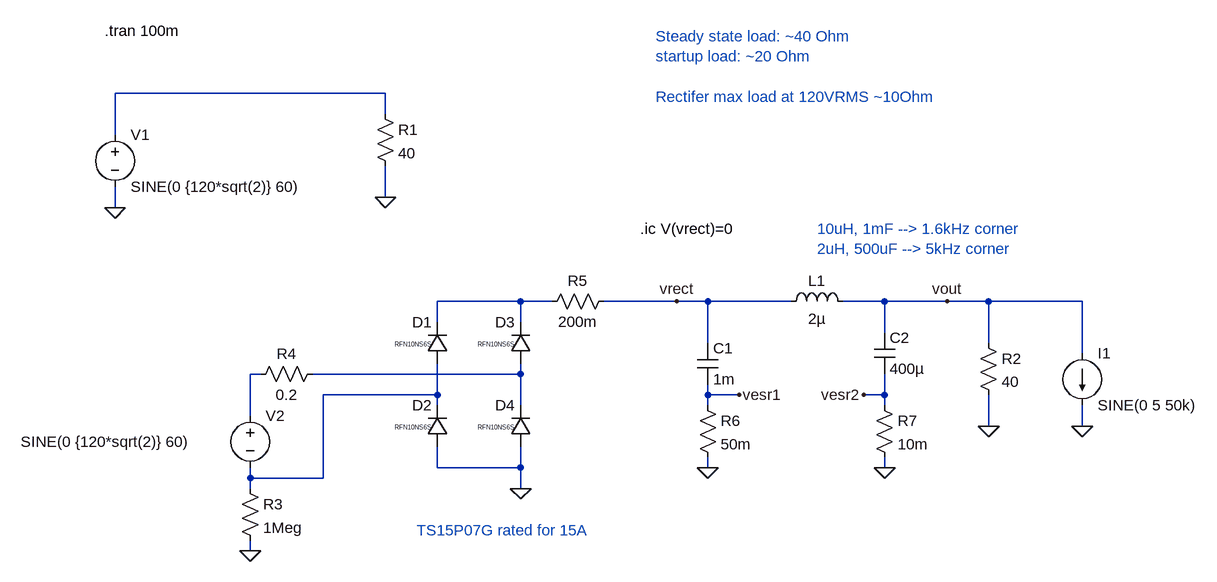
[diagram p0: schematic pump_ac_model.asc]
pump_ac_model.asc, the LTspice schematic file:
Version 4.1
SHEET 1 1792 756
WIRE 528 32 112 32
WIRE 528 64 528 32
WIRE 112 96 112 32
WIRE 528 192 528 144
WIRE 112 208 112 176
WIRE 736 352 608 352
WIRE 784 352 736 352
WIRE 976 352 864 352
WIRE 1024 352 976 352
WIRE 1152 352 1024 352
WIRE 1296 352 1232 352
WIRE 1392 352 1296 352
WIRE 1456 352 1392 352
WIRE 1600 352 1456 352
WIRE 608 384 608 352
WIRE 736 384 736 352
WIRE 1296 400 1296 352
WIRE 1024 416 1024 352
WIRE 1456 416 1456 352
WIRE 1600 432 1600 352
WIRE 336 464 320 464
WIRE 736 464 736 448
WIRE 736 464 416 464
WIRE 608 496 608 448
WIRE 608 496 432 496
WIRE 1024 496 1024 480
WIRE 1072 496 1024 496
WIRE 1296 496 1296 464
WIRE 1296 496 1264 496
WIRE 608 512 608 496
WIRE 736 512 736 464
WIRE 1024 512 1024 496
WIRE 1296 512 1296 496
WIRE 320 528 320 464
WIRE 1456 544 1456 496
WIRE 1600 544 1600 512
WIRE 608 608 608 576
WIRE 736 608 736 576
WIRE 736 608 608 608
WIRE 1024 608 1024 592
WIRE 1296 608 1296 592
WIRE 320 624 320 608
WIRE 432 624 432 496
WIRE 432 624 320 624
WIRE 320 640 320 624
WIRE 736 640 736 608
WIRE 320 736 320 720
FLAG 112 208 0
FLAG 528 192 0
FLAG 320 736 0
FLAG 1456 544 0
FLAG 736 640 0
FLAG 1024 608 0
FLAG 976 352 vrect
FLAG 1296 608 0
FLAG 1600 544 0
FLAG 1392 352 vout
FLAG 1072 496 vesr1
FLAG 1264 496 vesr2
SYMBOL voltage 112 80 R0
WINDOW 123 0 0 Left 0
WINDOW 39 0 0 Left 0
SYMATTR InstName V1
SYMATTR Value SINE(0 {120*sqrt(2)} 60)
SYMBOL res 512 48 R0
SYMATTR InstName R1
SYMATTR Value 40
SYMBOL voltage 320 512 R0
WINDOW 3 -353 56 Left 2
WINDOW 123 0 0 Left 0
WINDOW 39 0 0 Left 0
SYMATTR InstName V2
SYMATTR Value SINE(0 {120*sqrt(2)} 60)
SYMBOL res 1440 400 R0
SYMATTR InstName R2
SYMATTR Value 40
SYMBOL diode 624 448 R180
WINDOW 0 24 64 Left 2
WINDOW 3 24 30 Left 0
SYMATTR InstName D1
SYMATTR Value RFN10NS6S
SYMBOL res 304 624 R0
SYMATTR InstName R3
SYMATTR Value 1Meg
SYMBOL cap 1008 416 R0
SYMATTR InstName C1
SYMATTR Value 1m
SYMBOL diode 624 576 R180
WINDOW 0 24 64 Left 2
WINDOW 3 24 30 Left 0
SYMATTR InstName D2
SYMATTR Value RFN10NS6S
SYMBOL diode 752 448 R180
WINDOW 0 24 64 Left 2
WINDOW 3 24 30 Left 0
SYMATTR InstName D3
SYMATTR Value RFN10NS6S
SYMBOL diode 752 576 R180
WINDOW 0 24 64 Left 2
WINDOW 3 24 30 Left 0
SYMATTR InstName D4
SYMATTR Value RFN10NS6S
SYMBOL res 432 448 R90
WINDOW 0 0 56 VBottom 2
WINDOW 3 32 56 VTop 2
SYMATTR InstName R4
SYMATTR Value 0.2
SYMBOL res 880 336 R90
WINDOW 0 0 56 VBottom 2
WINDOW 3 32 56 VTop 2
SYMATTR InstName R5
SYMATTR Value 200m
SYMBOL ind 1136 368 R270
WINDOW 0 32 56 VTop 2
WINDOW 3 5 56 VBottom 2
SYMATTR InstName L1
SYMATTR Value 2µ
SYMBOL cap 1280 400 R0
SYMATTR InstName C2
SYMATTR Value 400µ
SYMBOL current 1600 432 R0
WINDOW 123 0 0 Left 0
WINDOW 39 0 0 Left 0
SYMATTR InstName I1
SYMATTR Value SINE(0 5 50k)
SYMBOL res 1008 496 R0
SYMATTR InstName R6
SYMATTR Value 50m
SYMBOL res 1280 496 R0
SYMATTR InstName R7
SYMATTR Value 10m
TEXT 96 -64 Left 2 !.tran 100m
TEXT 944 -56 Left 2 ;Steady state load: ~40 Ohm\nstartup load: ~20 Ohm\n \nRectifer max load at 120VRMS ~10Ohm
TEXT 920 240 Left 2 !.ic V(vrect)=0
TEXT 576 704 Left 2 ;TS15P07G rated for 15A
TEXT 1192 240 Left 2 ;10uH, 1mF --> 1.6kHz corner\n2uH, 500uF --> 5kHz corner

The netlist it stands for:
* pump_ac_model.asc
V1 N001 0 SINE(0 {120*sqrt(2)} 60)
R1 N001 0 40
V2 N003 N005 SINE(0 {120*sqrt(2)} 60)
R2 vout 0 40
D1 N005 N002 RFN10NS6S
R3 N005 0 1Meg
C1 vrect vesr1 1m
D2 0 N005 RFN10NS6S
D3 N004 N002 RFN10NS6S
D4 0 N004 RFN10NS6S
R4 N004 N003 0.2
R5 vrect N002 200m
L1 vrect vout 2µ
C2 vout vesr2 400µ
I1 vout 0 SINE(0 5 50k)
R6 vesr1 0 50m
R7 vesr2 0 10m
.model D D
.lib standard.dio
.tran 100m
* Steady state load: ~40 Ohm
* startup load: ~20 Ohm
* Rectifer max load at 120VRMS ~10Ohm
.ic V(vrect)=0
* TS15P07G rated for 15A
* 10uH, 1mF --> 1.6kHz corner
* 2uH, 500uF --> 5kHz corner
.backanno
.end